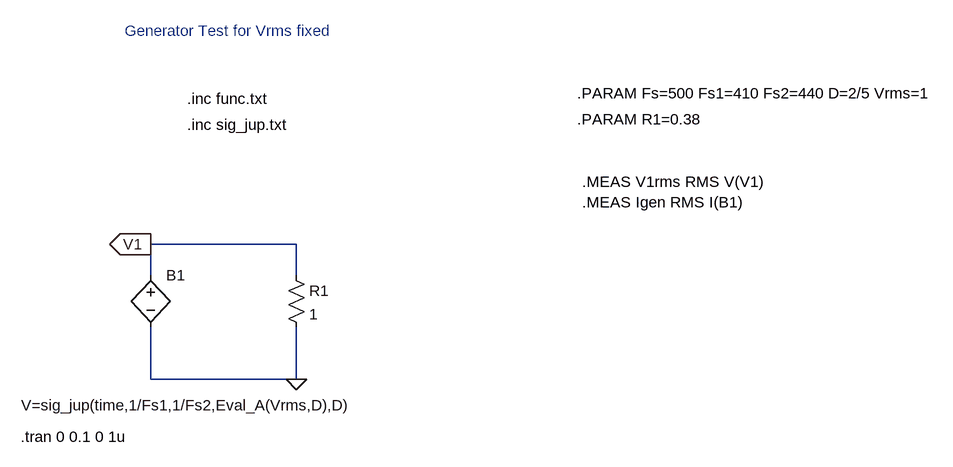
[diagram p0: schematic Rms_Sig_jupE.asc]
Rms_Sig_jupE.asc, the LTspice schematic file:
Version 4
SHEET 1 1564 680
WIRE -448 -224 -672 -224
WIRE -672 -176 -672 -224
WIRE -448 -176 -448 -224
WIRE -672 -16 -672 -96
WIRE -448 -16 -448 -96
WIRE -448 -16 -672 -16
FLAG -672 -224 V1
IOPIN -672 -224 Out
FLAG -448 -16 0
SYMBOL bv -672 -192 R0
WINDOW 3 -199 216 Left 2
SYMATTR Value V=sig_jup(time,1/Fs1,1/Fs2,Eval_A(Vrms,D),D)
SYMATTR InstName B1
SYMBOL res -464 -192 R0
SYMATTR InstName R1
SYMATTR Value 1
TEXT -616 -448 Left 2 !.inc func.txt
TEXT -872 72 Left 2 !.tran 0 0.1 0 1u
TEXT -8 -320 Left 2 !.MEAS V1rms RMS V(V1)\n.MEAS Igen RMS I(B1)
TEXT -16 -416 Left 2 !.PARAM R1=0.38
TEXT -16 -456 Left 2 !.PARAM Fs=500 Fs1=410 Fs2=440 D=2/5 Vrms=1
TEXT -616 -408 Left 2 !.inc sig_jup.txt
TEXT -712 -552 Left 2 ;Generator Test for Vrms fixed

The netlist it stands for:
* Rms_Sig_jupE.asc
B1 V1 0 V=sig_jup(time,1/Fs1,1/Fs2,Eval_A(Vrms,D),D)
R1 V1 0 1
.inc func.txt
.tran 0 0.1 0 1u
.MEAS V1rms RMS V(V1)
.MEAS Igen RMS I(B1)
.PARAM R1=0.38
.PARAM Fs=500 Fs1=410 Fs2=440 D=2/5 Vrms=1
.inc sig_jup.txt
* Generator Test for Vrms fixed
.backanno
.end